# EasyEDA Pro project test_for_1.69.eprj

# Schematic Schematic1
Board Name: Board1; Create Date: 2025-01-09; Page Name: P1; Project Name: test_for_1.69; Schematic Name: Schematic1; Update Date: 2025-01-09; Company: EasyEDA.com; Page Size: A4; Version: V1.0
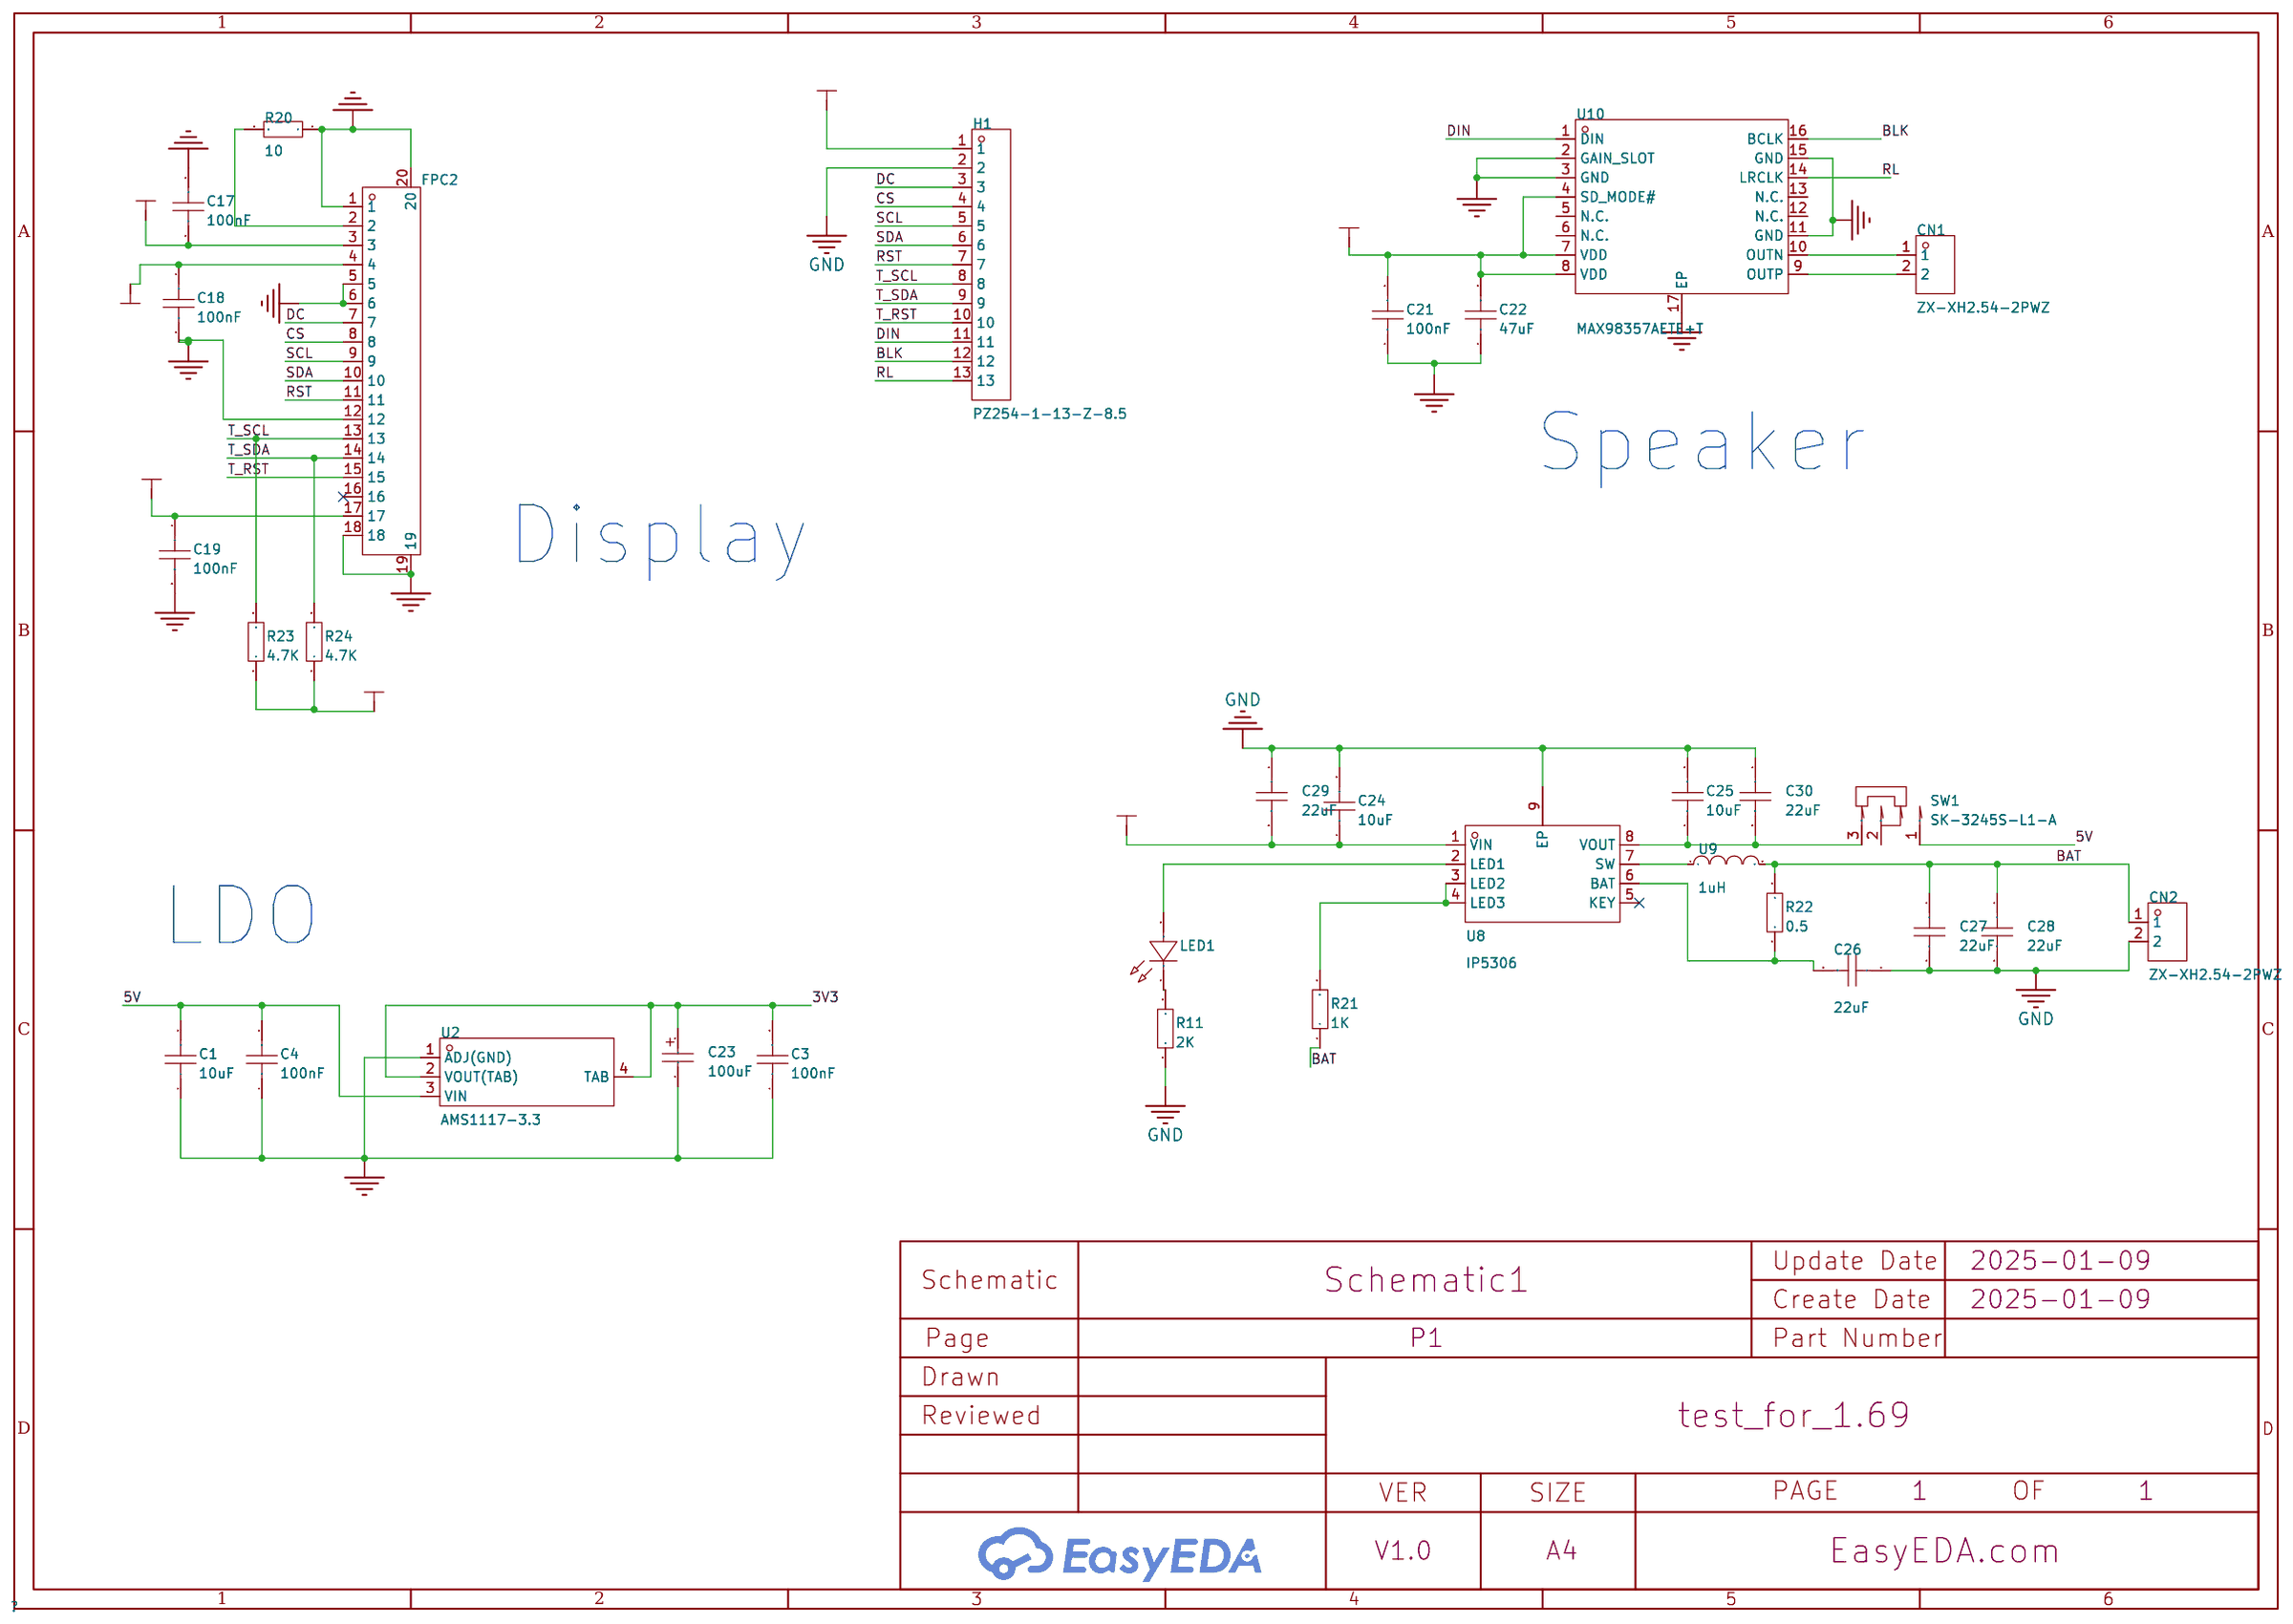
[diagram p0: schematic sheet]

## Parts
C1  10uF  [C0603]
C3  100nF  [C0402]
C4  100nF  [C0402]
C17  100nF  [C0402]
C18  100nF  [C0402]
C19  100nF  [C0402]
C21  100nF  [C0402]
C22  47uF  [C0603]
C23  100uF  [CASE-B_3528]
C24  10uF  [C0603]
C25  10uF  [C0603]
C26  22uF  [C0603]
C27  22uF  [C0603]
C28  22uF  [C0603]
C29  22uF  [C0603]
C30  22uF  [C0603]
CN1  ZX-XH2.54-2PWZ  [CONN-TH_2P-P2.50_ZX-XH2.54-2PWZ]
CN2  ZX-XH2.54-2PWZ  [CONN-TH_2P-P2.50_ZX-XH2.54-2PWZ]
FPC2  FPC-05F-18PH20  [FPC-SMD_18P-P0.50_FPC-05F-18PH20]
H1  PZ254-1-13-Z-8.5  [HDR-TH_13P-P2.54-V-M]
LED1  XL-1608SURC-06  [LED0603-RD_RED]
R11  2K  [R0402]
R20  10  [R0402]
R21  1K  [R0402]
R22  1K  [R0402]
R23  4.7K  [R0402]
R24  4.7K  [R0402]
SW1  SK-3245S-L1-A  [SW-SMD_SK-3245S-L1-A-1]
U2  AMS1117-3.3  [SOT-223-4_L6.5-W3.5-P2.30-LS7.0-BR]
U8  IP5306  [ESOP-8_L4.9-W3.9-P1.27-LS6.0-BL-EP]
U9  1uH  [IND-SMD_L2.5-W2.0_YXNAQ252010-3R3M]
U10  MAX98357AETE+T  [TQFN-16_L3.0-W3.0-P0.50-BL-EP1.5]

## Library data of the parts
C1 C24-C30 = CGA0603X5R106K100JT: 容值:10uF;精度:±10%;额定电压:10V;材质(温度系数):X5R;; LCSC Part Name: 10uF ±10% 10V; Supplier Part: C6119842; Manufacturer: HRE(芯声); Supplier Footprint: 0603; JLCPCB Part Class: 扩展库; Supplier: LCSC; Tolerance: ±10%; Voltage Rated: 10V; Temperature Coefficient: X5R
C3 C4 C17-C19 C21 = CL05B104KO5NNNC: 容值:100nF;精度:±10%;额定电压:16V;材质(温度系数):X7R;; LCSC Part Name: 100nF ±10% 16V; Supplier Part: C1525; Manufacturer: SAMSUNG(三星); Supplier Footprint: 0402; Datasheet: https://atta.szlcsc.com/upload/public/pdf/source/20160218/1457707763339.pdf; Supplier: LCSC; Tolerance: ±10%; Voltage Rated: 16V; Temperature Coefficient: X7R
C22 = CL10A476MQ8QRNC: 容值:47uF;精度:±20%;额定电压:6.3V;材质(温度系数):X5R;; LCSC Part Name: 47uF ±20% 6.3V; Supplier Part: C730416; Manufacturer: SAMSUNG(三星); Supplier Footprint: 0603; JLCPCB Part Class: 扩展库; Datasheet: https://atta.szlcsc.com/upload/public/pdf/source/20160218/1457707763339.pdf; Supplier: LCSC; Tolerance: ±20%; Voltage Rated: 6.3V; Temperature Coefficient: X5R
C23 = TAJB107K006RNJ: Capacitance: Tolerance:±10% Tolerance:±10% Rated Voltage: Equivalent Series Resistance(ESR):1.7Ω@100kHz Operating Temperature:-55℃~+125℃ Operating Temperature:-55℃~+125℃; LCSC Part Name: 100uF ±10% 6.3V; Supplier Part: C16133; Manufacturer: Kyocera AVX; Supplier Footprint: CASE-B-3528-21(mm); JLCPCB Part Class: Basic Part; Datasheet: https://atta.szlcsc.com/upload/public/pdf/source/20160107/1457707750344.pdf; Supplier: LCSC; Tolerance: ±10%; Equivalent Series Resistance(ESR): 1.7Ω@100kHz; Operating Temperature: -55℃~+125℃
CN1 CN2 = ZX-XH2.54-2PWZ: 插针结构:1x2P;间距:2.54mm;安装方式:弯插;参考系列:XH;总PIN数:2P;排数:1;每排PIN数:2;行距:-;额定电流:3A;触头材质:黄铜;触头镀层:锡;工作温度范围:-25℃~+85℃;; Supplier Part: C7429641; Manufacturer: Megastar(兆星); Supplier Footprint: 弯插,P=2.54mm; JLCPCB Part Class: 扩展库; Datasheet: https://atta.szlcsc.com/upload/public/pdf/source/20230619/56AE8F2E01CDFEAA97FC89B5ED558AB5.pdf; Supplier: LCSC; Pins Structure: 1x2P; Pitch: 2.54mm; Mounting Style: 弯插; Reference Series: XH; Number of Pins: 2P; Number of Rows: 1; Number of PINs Per Row: 2; Current Rating (Max): 3A; Contact Material: 黄铜; Contact Plating: 锡; Operating Temperature Range: -25℃~+85℃
FPC2 = FPC-05F-18PH20: 锁定特性:翻盖式;触点类型:下接;触点数量:18P;间距:0.5mm;安装类型:卧贴;工作温度范围:-25℃~+85℃;; LCSC Part Name: 间距:0.5mm P数:18P 翻盖式 下接; Supplier Part: C2856802; Manufacturer: XUNPU(讯普); Supplier Footprint: SMD,P=0.5mm,卧贴; Datasheet: https://atta.szlcsc.com/upload/public/pdf/source/20210922/C2856802_2A845D1961F33AEC1ED22CECB292335F.pdf; Supplier: LCSC; Locking Feature: 翻盖式; Contact Type: 下接; Number of Contacts: 18P; Pitch: 0.5mm; Mounting Type: 卧贴; FFC, FCB Thickness: 0.3mm; Height Above Board: 2mm; Operating Temperature Range: -25℃~+85℃
H1 = PZ254-1-13-Z-8.5: LCSC Part Name: 1x13P 间距:2.54mm 方针 直插; Supplier Part: C2894936; Manufacturer: HCTL(华灿天禄); Supplier Footprint: 插件,P=2.54mm; JLCPCB Part Class: Extended Part; Datasheet: https://atta.szlcsc.com/upload/public/pdf/source/20240305/0F0A2A5C422E5D195558C9C26715A031.pdf; Supplier: LCSC; Pin Structure: 1x13P; Pitch: 2.54mm; Circluar Pins/Square Pins: Square Pins; Mounting Type: Straight; Number of Rows: Plugin; Number of Pins: 13P; Current Rating (Max): 3A; Length of Mating Pin: 6mm; Insulation Height: 2.5mm; Length of End Connection Pin: 3mm; Operating Temperature Range: -40℃~+105℃; Soldering Temperature(Max): 260℃@10S; Color: Black
LED1 = XL-1608SURC-06: 发光颜色:红色;功率:55mW;正向电流:25mA;主波长:617nm~621nm;透镜颜色:无色透明透镜;色温:-;发光角度:120°;载带方式:正贴;工作温度:-30℃~+85℃;; Supplier Part: C965799; Manufacturer: XINGLIGHT(成兴光); Supplier Footprint: 0603; JLCPCB Part Class: 扩展库; Datasheet: https://atta.szlcsc.com/upload/public/pdf/source/20221102/D860AFDD1CDB02C5A8064103A32707E2.pdf; Supplier: LCSC; Emitted Color: 红色; Power Dissipation: 55mW; Forward Current: 25mA; Dominant Wavelength: 617nm~621nm; Peak Wavelength: 623nm; Lens Color: 无色透明透镜; Viewing Angle: 120°; Mounting Sytle: 正贴; Operating Temperature: -30℃~+85℃
R11 R20-R24 = 0402WGF4700TCE: 电阻类型:厚膜电阻;阻值:470Ω;精度:±1%;功率:62.5mW;最大工作电压:50V;温度系数:±100ppm/℃;; LCSC Part Name: 470Ω ±1% 62.5mW 厚膜电阻; Supplier Part: C25117; Manufacturer: UNI-ROYAL(厚声); Supplier Footprint: 0402; JLCPCB Part Class: 基础库; Datasheet: https://atta.szlcsc.com/upload/public/pdf/source/20200306/C422600_1E6D84923E4A46A82E41ADD87F860B5C.pdf; Supplier: LCSC; Type: 厚膜电阻; Tolerance: ±1%; Power(Watts): 62.5mW; Overload Voltage (Max): 50V; Temperature Coefficient: ±100ppm/℃; Operating Temperature Range: -55℃~+155℃
SW1 = SK-3245S-L1-A: LCSC Part Name: 柄长2mm 卧贴双档 滑动开关; Supplier Part: C405951; Manufacturer: XKB Connection(中国星坤); Supplier Footprint: SMD; JLCPCB Part Class: Extended Part; Datasheet: https://atta.szlcsc.com/upload/public/pdf/source/20200227/C405951_CBAB505F81ACCB08512C6DA919ADD92C.pdf; Supplier: LCSC; Circuit: DPDT; Actuator Style: Rectangular columnar; Pin Style: SMDSplicing; Switch Length: 9.1mm; Switch Width: 3.55mm; Switch Height: 3.2mm; Mounting Style: 卧贴; Actuator Color: Black; Current Rating (DC): 50mA; Voltage Rating (DC): 12V; Current Rating (AC): 50mA; Voltage Rating (AC): 12V; Mechanical Life: 1万次; Operating Temperature: -40℃~+85℃
U2 = AMS1117-3.3_C347222: 输出类型:固定;工作电压:12V;输出电压:3.3V;输出电流:1A;电源纹波抑制比(PSRR):60dB@(120Hz);输出极性:正极;; LCSC Part Name: 输出:3.3V 电流:1A 耐压:12V; Supplier Part: C347222; Manufacturer: UMW(友台半导体); Supplier Footprint: SOT-223; JLCPCB Part Class: 扩展库; Datasheet: https://atta.szlcsc.com/upload/public/pdf/source/20241218/BAF0263FA2E44BCD8AF41AA4FA04EFAA.pdf; Supplier: LCSC; Output Type: 固定; Maximum Input Voltage: 12V; Output Voltage: 3.3V; Output Current: 1A; Power Supply Rejection Ratio (PSRR): 60dB@(120Hz); Dropout Voltage: 1.3V@(1A); Feature: 过流保护(OCP); Output Polarity: 正极; Number of Outputs: 1
U8 = IP5306: Supplier Part: C181692; Manufacturer: INJOINIC(英集芯); Supplier Footprint: ESOP-8; JLCPCB Part Class: Extended Part; Datasheet: https://atta.szlcsc.com/upload/public/pdf/source/20190627/C384572_9925B3DDC4041BC6108E5AB46A2A0AB1.pdf; Supplier: LCSC
U9 = IND\L2.5XW: Supplier Part: C9900016568; Supplier Footprint: 2.2uH/60; JLCPCB Part Class: Extended Part; Supplier: LCSC
U10 = MAX98357AETE+T: 功放类型:-;扬声器通道数:单声道;输出功率:3.2Wx2@4Ω;; LCSC Part Name: 微型、低成本、PCM 类 D 级放大器具有 AB 级性能; Supplier Part: C910544; Manufacturer: ADI(亚德诺)/MAXIM(美信); Supplier Footprint: TQFN-16-EP(3x3); JLCPCB Part Class: 扩展库; Datasheet: https://atta.szlcsc.com/upload/public/pdf/source/20210106/C910544_CB6DE4B2CEE254A72E6BDB40E718D281.pdf; Supplier: LCSC; Speaker Channels: 单声道; Output Power: 3.2Wx2@4Ω; Supply Voltage: 2.5V~5.5V; Operating Temperature: -40℃~+85℃

## Nets
3V3: C3.2 C17.2 C18.1 C19.1 C21.2 C22.2 C23.1 FPC2.3 FPC2.4 FPC2.17 R23.1 R24.1 U2.2(VOUT(TAB)) U2.4(TAB) U10.4(SD_MODE#) U10.7(VDD) U10.8(VDD)
5V: C1.2 C4.2 SW1.1 U2.3(VIN)
5V_IN: C24.1 C29.2 H1.1 U8.1(VIN)
GND: C1.1 C3.1 C4.1 C17.1 C18.2 C19.2 C21.1 C22.1 C23.2 C24.2 C25.2 C26.1 C27.2 C28.2 C29.1 C30.1 CN2.2 FPC2.1 FPC2.5 FPC2.6 FPC2.12 FPC2.18 FPC2.19 FPC2.20 H1.2 R11.1 R20.1 U2.1(ADJ(GND)) U8.9(EP) U10.2(GAIN_SLOT) U10.3(GND) U10.11(GND) U10.15(GND) U10.17(EP)
BAT: C27.1 C28.1 CN2.1 R21.1 R22.2 U9.2
BLK: H1.12 U10.16(BCLK)
CS: FPC2.8 H1.4
DC: FPC2.7 H1.3
DIN: H1.11 U10.1(DIN)
RL: H1.13 U10.14(LRCLK)
RST: FPC2.11 H1.7
SCL: FPC2.9 H1.5
SDA: FPC2.10 H1.6
T_RST: FPC2.15 H1.10
T_SCL: FPC2.13 H1.8 R23.2
T_SDA: FPC2.14 H1.9 R24.2
$1N392: FPC2.2 R20.2
$1N689: CN1.1 U10.10(OUTN)
$1N690: CN1.2 U10.9(OUTP)
$1N3949: LED1.2(A) U8.2(LED1)
$1N3991: LED1.1(K) R11.2
$1N4023: R21.2 U8.3(LED2) U8.4(LED3)
$1N4116: C25.1 C30.2 SW1.3 U8.8(VOUT)
$1N4277: U8.7(SW) U9.1
$1N4384: C26.2 R22.1 U8.6(BAT)

Not connected (* = marked no-connect by the designer): FPC2 16*; SW1 2; U8 5(KEY)*; U10 5(N.C.) 6(N.C.) 12(N.C.) 13(N.C.)

## Notes on the sheet
- Speaker
- Display
- LDO

# Board PCB1
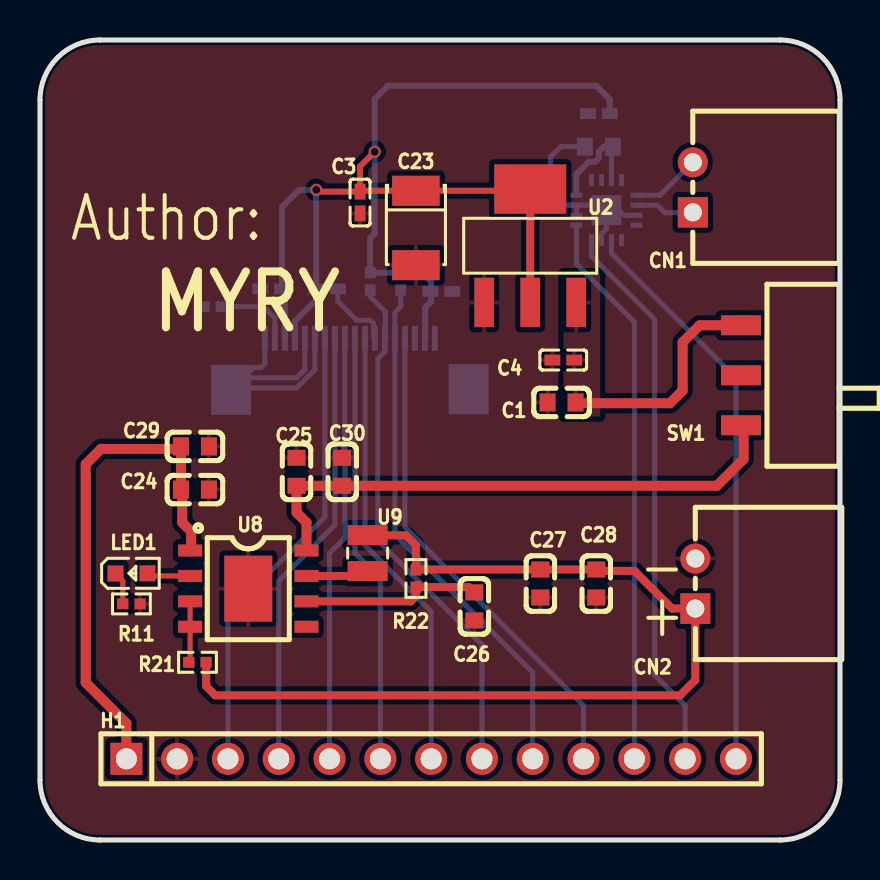
[diagram p1: board, top side]
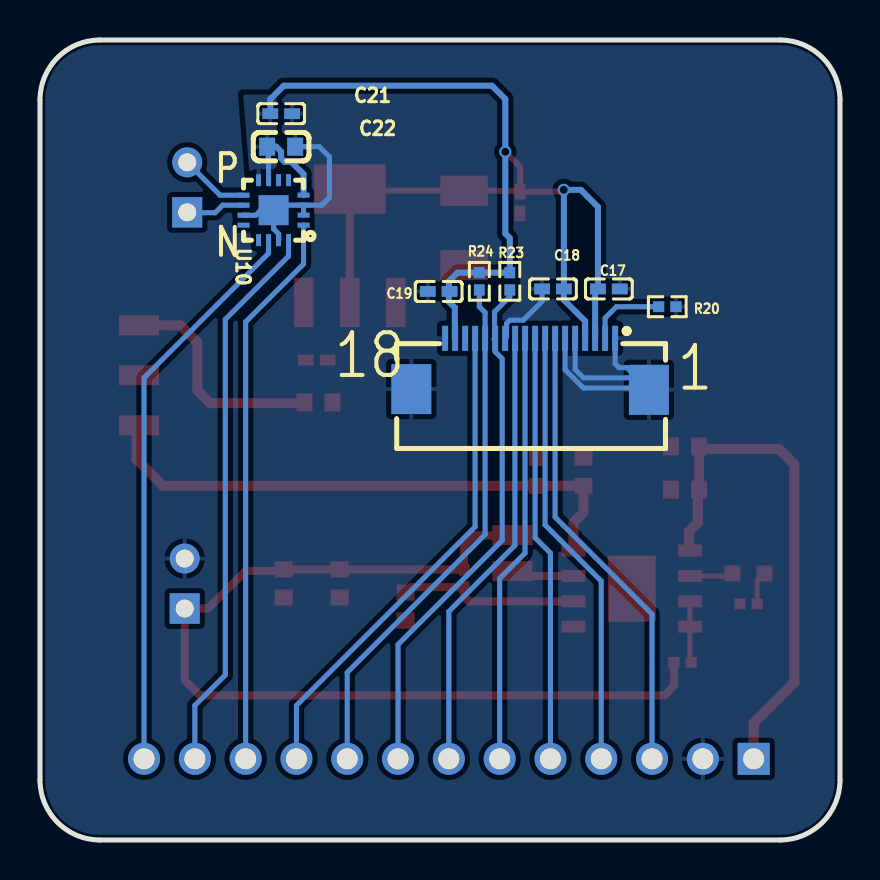
[diagram p2: board, bottom side, seen from below]

Outline 40 x 40 mm; copper layers: Top Layer, Bottom Layer. Coordinates in mm from the lower left corner of the outline.
Outline path: 0,37 0,3 arc(0.88,0.88) 3,0 37,0 arc(39.12,0.88) 40,3 40,37 arc(39.12,39.12) 37,40 3,40 arc(0.88,39.12) 0,37
Stack: Top Layer 0.035mm / Dielectric1 1.51mm FR4 er 4.5 / Bottom Layer 0.035mm

## Design rules (mm)
template: JLCPCB Capability(Two Layers Board)
spacing copperThickness1oz (default): track to track 0.102, other pairs 0.152 to 0.3
spacing copperThickness2oz: track to track 0.203, other pairs 0.152 to 0.3
track width copperThickness1oz (default): min 0.127, default 0.254, max 2.54
track width copperThickness2oz: min 0.203, default 0.254, max 2.54
differential pair differentialPair (default): width min 0.127, default 0.254, max 2.54; gap min 0.152, default 0.152
via viaSize (default): diameter min 0.5, default 0.61, max 10; hole min 0.3, default 0.305, max 6.3

## Placement (name value [footprint] x y rotation side)
C1  10uF  [C0603]  26.08 21.88 0 top
C3  100nF  [C0402]  16 31.87 90 top
C4  100nF  [C0402]  26.16 24 0 top
C17  100nF  [C0402]  11.56 27.55 0 bottom
C18  100nF  [C0402]  14.35 27.55 0 bottom
C19  100nF  [C0402]  20.07 27.43 0 bottom
C21  100nF  [C0402]  27.94 36.32 0 bottom
C22  47uF  [C0603]  27.94 34.67 0 bottom
C23  100uF  [CASE-B_3528]  18.8 30.6 270 top
C24  10uF  [C0603]  7.75 17.52 0 top
C25  10uF  [C0603]  12.83 18.41 90 top
C26  22uF  [C0603]  21.72 11.68 90 top
C27  22uF  [C0603]  25.02 12.82 270 top
C28  22uF  [C0603]  27.81 12.82 270 top
C29  22uF  [C0603]  7.75 19.68 180 top
C30  22uF  [C0603]  15.11 18.41 270 top
CN1  ZX-XH2.54-2PWZ  [CONN-TH_2P-P2.50_ZX-XH2.54-2PWZ]  32.64 32.63 90 top
CN2  ZX-XH2.54-2PWZ  [CONN-TH_2P-P2.50_ZX-XH2.54-2PWZ]  32.77 12.82 90 top
FPC2  FPC-05F-18PH20  [FPC-SMD_18P-P0.50_FPC-05F-18PH20]  15.49 23.8 180 bottom
H1  PZ254-1-13-Z-8.5  [HDR-TH_13P-P2.54-V-M]  19.56 4.06 0 top
LED1  XL-1608SURC-06  [LED0603-RD_RED]  4.57 13.33 0 top
R11  2K  [R0402]  4.57 11.81 180 top
R20  10  [R0402]  8.64 26.66 0 bottom
R21  1K  [R0402]  7.87 8.88 180 top
R22  1K  [R0402]  18.8 13.08 90 top
R23  4.7K  [R0402]  16.51 27.94 270 bottom
R24  4.7K  [R0402]  18.03 27.94 270 bottom
SW1  SK-3245S-L1-A  [SW-SMD_SK-3245S-L1-A-1]  35.05 23.24 270 top
U2  AMS1117-3.3  [SOT-223-4_L6.5-W3.5-P2.30-LS7.0-BR]  24.51 29.71 270 top
U8  IP5306  [ESOP-8_L4.9-W3.9-P1.27-LS6.0-BL-EP]  10.41 12.57 270 top
U9  1uH  [IND-SMD_L2.5-W2.0_YXNAQ252010-3R3M]  16.38 14.35 270 top
U10  MAX98357AETE+T  [TQFN-16_L3.0-W3.0-P0.50-BL-EP1.5]  28.32 31.49 90 bottom

## Footprints (pads in the part's own frame, mm; a bottom-side part is the same pattern mirrored in y, then rotated)
C0402
  rect 0.79x0.54 smd: 1(-0.545,0) 2(0.545,0)
C0603
  rect 0.8x0.9 smd: 1(-0.7,0) 2(0.7,0)
CASE-B_3528
  rect 1.506x2.376 smd: 1(-1.861,0) 2(1.861,0)
CONN-TH_2P-P2.50_ZX-XH2.54-2PWZ
  rect 1.524x1.5 hole 0.9: 1(-1.25,0)
  round 1.5 hole 0.9: 2(1.25,0)
ESOP-8_L4.9-W3.9-P1.27-LS6.0-BL-EP
  rect 0.6x1.2 smd: 1(-1.905,-2.909) 2(-0.635,-2.909) 3(0.635,-2.909) 4(1.905,-2.909) 5(1.905,2.909) 6(0.635,2.909) 7(-0.635,2.909) 8(-1.905,2.909)
  rect 3.3x2.4 smd: 9(0,0)
FPC-SMD_18P-P0.50_FPC-05F-18PH20
  rect 0.3x1.25 smd: 1(4.25,1.288) 2(3.75,1.288) 3(3.25,1.288) 4(2.75,1.288) 5(2.25,1.288) 6(1.75,1.288) 7(1.25,1.288) 8(0.75,1.288) 9(0.25,1.288) 10(-0.25,1.288) 11(-0.75,1.288) 12(-1.25,1.288) 13(-1.75,1.288) 14(-2.25,1.288) 15(-2.75,1.288) 16(-3.25,1.288) 17(-3.75,1.288) 18(-4.25,1.288)
  rect 2x2.5 smd: 19(5.94,-1.288) 20(-5.94,-1.252)
HDR-TH_13P-P2.54-V-M
  rect 1.6x1.6 hole 1.05: 1(-15.24,0)
  round 1.6 hole 1.05: 2(-12.7,0) 3(-10.16,0) 4(-7.62,0) 5(-5.08,0) 6(-2.54,0) 7(0,0) 8(2.54,0) 9(5.08,0) 10(7.62,0) 11(10.16,0) 12(12.7,0) 13(15.24,0)
IND-SMD_L2.5-W2.0_YXNAQ252010-3R3M
  rect 1x2 smd: 1(0.9,0) 2(-0.9,0)
LED0603-RD_RED
  rect 0.8x0.8 smd: 1(-0.799,-0.004) 2(0.799,0.004)
R0402
  rect 0.566x0.54 smd: 1(-0.433,0) 2(0.433,0)
SOT-223-4_L6.5-W3.5-P2.30-LS7.0-BR
  rect 2.47x0.98 smd: 1(2.835,-2.3) 2(2.835,0) 3(2.835,2.3)
  rect 2.47x3.6 smd: 4(-2.835,0)
SW-SMD_SK-3245S-L1-A-1
  rect 1x2 smd: 1(-2.5,0) 2(0,0) 3(2.5,0)
TQFN-16_L3.0-W3.0-P0.50-BL-EP1.5
  rect 0.25x0.6 smd: 1(-0.749,-1.5) 2(-0.248,-1.5) 3(0.252,-1.5) 4(0.751,-1.5) 9(0.75,1.5) 10(0.25,1.5) 11(-0.25,1.5) 12(-0.749,1.5)
  rect 0.6x0.25 smd: 5(1.5,-0.748) 6(1.5,-0.248) 7(1.5,0.252) 8(1.5,0.752) 13(-1.5,0.752) 14(-1.5,0.252) 15(-1.5,-0.248) 16(-1.5,-0.748)
  rect 1.5x1.5 smd: 17(0,0)

## Nets
As in the schematic.

Pads without a net: FPC2 16; SW1 2; U8 5; U10 5 6 12 13

## Via types
v1: diameter 0.61, hole 0.4, Top Layer to Bottom Layer, 2 vias

## Routing (per net, layer and track width the routed paths; a pad name or vN(x,y) marks a point on that pad's centre or on a via; arc(x,y) is an arc through that point)
3V3: length 68.7
  Top Layer w0.3: v1(16.73,34.41) 16,33.68 C3.2 ; C3.2 13.9,32.42 v1(13.81,32.51) ; C3.2 16.05,32.46 C23.1 24.43,32.46 U2.4
  Top Layer w0.4: U2.4 U2.2
  Bottom Layer w0.254: U10.7 28.57,34.6 C22.2 ; C17.2 12.24,27.41
  Bottom Layer w0.3: FPC2.17 19.26,25.1 19.26,26.62 19.56,26.92 19.56,27.94 19.12,28.37 16.51,28.37 16.51,30.09 16.73,30.32 v1(16.73,34.41) 16.73,37.05 17.4,37.71 27.81,37.71 28.49,37.04 C21.2 ; C22.2 28.19,34.67 27.94,34.42 27.94,34.09 27.77,33.91 27.44,33.91 26.82,33.29 U10.4 ; 12.24,27.41 FPC2.3 ; FPC2.4 12.74,25.95 13.81,27.01 C18.1 13.81,32.5 v1(13.81,32.51) 12.95,32.51 12.1,31.66 C17.2
5V: length 11.3
  Top Layer w0.5: SW1.1 32.98,25.74 32.13,24.89 32.13,22.47 31.5,21.84 26.82,21.84 C1.2
5V_IN: length 26.1
  Top Layer w0.5: H1.1 4.32,5.84 2.29,7.87 2.29,18.79 3.05,19.55 6.92,19.55 C29.2 C24.1 7.11,17.46 7.11,15.87 7.56,15.43 7.56,14.52 U8.1
GND: length 28.7
  Bottom Layer w0.254: 9.64,22.6 FPC2.19 ; 9.64,22.6 12.83,22.6 13.74,23.52 FPC2.6 ; 9.64,22.6 10.15,23.11 ; U10.11 29.82,31.24 29.21,31.24 28.96,31.49 U10.17 ; U10.3 U10.2 ; U10.3 25.91,31.74 25.53,32.13 25.53,34.16 26.03,34.67 C22.1 ; U10.3 28.07,31.74 U10.17 ; 14.9,27.55 14.9,26.93 15.84,25.99 16.51,25.99 16.67,25.83 16.67,25.16 FPC2.12 ; U10.17 28.32,30.56 28.06,30.3 28.06,30 U10.15 ; 10.15,23.11 12.83,23.11 13.24,23.53 FPC2.5 ; 10.15,23.11 10.66,23.62 11.05,23.62 11.24,23.81 FPC2.1
BAT: length 48.4
  Top Layer w0.4: U9.2 16.39,15.23 18.29,15.23 18.8,14.73 R22.2 18.81,13.52 C27.1 C28.1 27.88,13.46 29.72,13.46 31.6,11.57 CN2.1 32.77,8 32,7.23 8.76,7.23 8.31,7.69 R21.1
BLK: length 27.9
  Bottom Layer w0.254: U10.16 27.57,29.19 30.73,26.03 30.73,8.25 32.26,6.73 H1.12
CS: length 22.2
  Bottom Layer w0.254: H1.4 11.94,12.95 14.74,15.75 FPC2.8
DC: length 23
  Bottom Layer w0.254: FPC2.7 14.24,16.14 9.4,11.3 H1.3
DIN: length 27.9
  Bottom Layer w0.254: H1.11 29.72,25.9 26.82,28.8 U10.1
RL: length 28.5
  Bottom Layer w0.254: H1.13 34.8,23.11 28.57,29.33 U10.14
RST: length 22.4
  Bottom Layer w0.254: FPC2.11 16.26,25.07 16.26,14.73 19.56,11.42 H1.7
SCL: length 21.3
  Bottom Layer w0.254: FPC2.9 15.24,15.11 14.48,14.35 H1.5
SDA: length 21.6
  Bottom Layer w0.254: H1.6 17.02,13.08 15.75,14.35 15.75,25.08 FPC2.10
T_RST: length 24.7
  Bottom Layer w0.254: H1.10 27.18,6.73 18.24,15.66 FPC2.15
T_SCL: length 26.1
  Bottom Layer w0.254: R23.2 16.51,27.17 17.27,26.41 17.27,25.11 FPC2.13 17.29,25.04 17.24,24.99 17.24,24.42 16.89,24.06 16.89,14.98 22.1,9.77 H1.8
T_SDA: length 26.4
  Bottom Layer w0.254: R24.2 18.03,26.66 17.74,26.38 FPC2.14 17.74,15.27 24.64,8.38 H1.9
$1N392: length 3.9
  Bottom Layer w0.254: FPC2.2 11.74,26.1 11.18,26.66 R20.2
$1N689: length 3
  Bottom Layer w0.254: U10.10 30.87,31.74 31.24,31.36 32.62,31.36 CN1.1
$1N690: length 3.5
  Bottom Layer w0.254: CN1.2 31,32.24 U10.9
$1N3949: length 2.2
  Top Layer w0.254: LED1.2 5.5,13.2 U8.2
$1N3991: length 1.7
  Top Layer w0.254: R11.2 4.14,12.96 LED1.1
$1N4023: length 3.1
  Top Layer w0.254: R21.2 7.51,8.95 U8.4 U8.3
$1N4116: length 28.1
  Top Layer w0.5: U8.8 13.32,15.88 12.83,16.38 C25.1 C30.2 33.84,17.71 35.18,19.05 35.18,20.61 SW1.3
$1N4277: length 3.2
  Top Layer w0.4: U9.1 16.14,13.2 U8.7
$1N4384: length 9.1
  Top Layer w0.4: C26.2 21.45,12.64 R22.1 18.8,12.19 18.54,11.93 U8.6

## Copper pours and planes (outline as drawn; the poured copper is in the pictures)
3V3 on Bottom Layer: 28.17,37.27 28.17,33.68 28.45,33.4 28.45,32.52 28.46,32.51 29.47,32.6 29.84,37.27
5V on Top Layer: 26.17,28.34 28.01,28.34 28.01,21.17 26.17,21.17
GND on Top Layer: -2.41,42.29 42.04,42.29 42.04,-2.55 -2.41,-2.55
GND on Bottom Layer: -1.65,41.52 42.04,41.52 42.04,-1.4 -1.65,-1.4

## Text on the board
Bottom Silkscreen Layer: P | N | 1 | 18
Top Silkscreen Layer: Author: | - | + | MYRY
